# Altium schematic sheet Snickerdoodle FPGA JB.SchDoc: Snickerdoodle JB
size Tabloid; ApprovedBy: NA; CompanyName: Cospan Design LLC; DrawnBy: Dave McCoy; Engineer: Dave McCoy; DocumentNumber: 5; Revision: A; SheetNumber: 5; SheetTotal: 20; Client: Public; Project: Enigma; ProjectPrettyName: Enigma
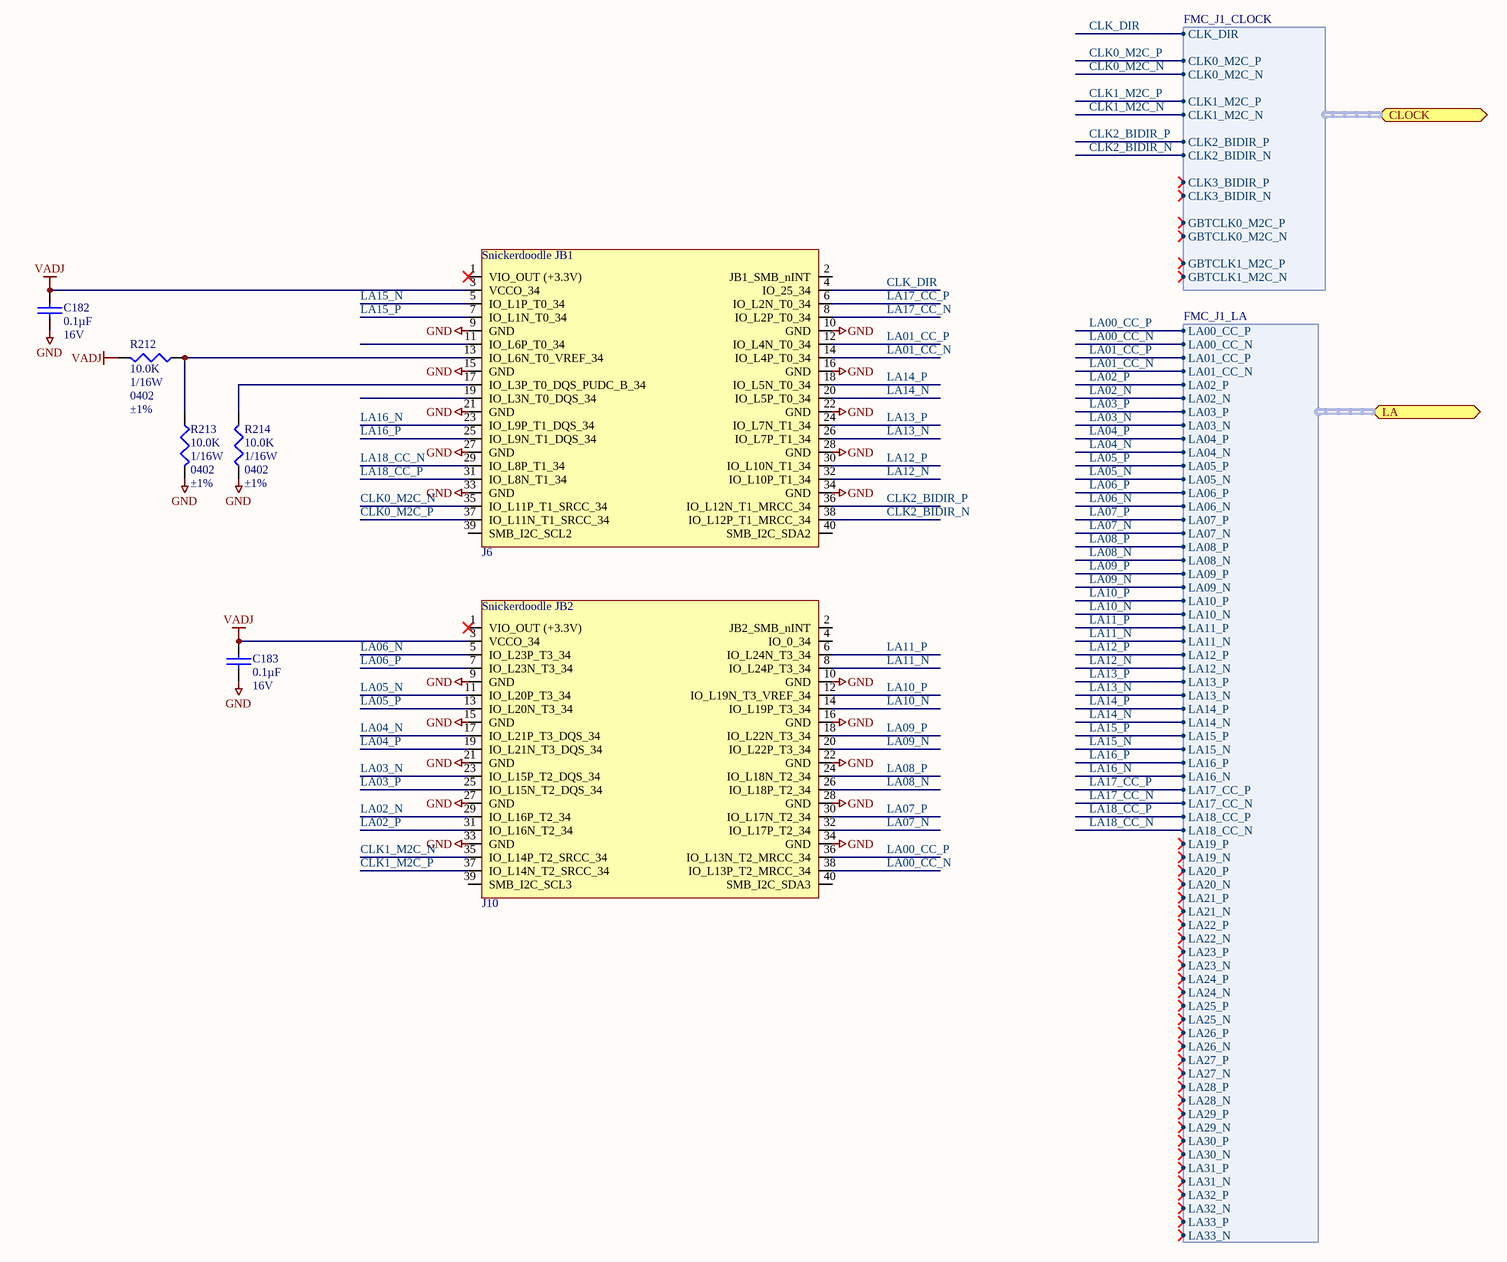
[diagram p0: Snickerdoodle FPGA JB.SchDoc]

## Parts
C182  Capacitance: 0.1µF  Voltage - Rated: 16V  [C_0402]  (hidden comment: 0.1uF)
C183  Capacitance: 0.1µF  Voltage - Rated: 16V  [C_0402]  (hidden comment: 0.1uF)
J6  J_SNICKERDOODLE_JB1  [TFM12001-X-D-A]  (value not drawn)
J10  J_SNICKERDOODLE_JB2  [TFM12001-X-D-A]  (value not drawn)
R212  Resistance In Ohms: 10.0K  Power (Watts): 1/16W  Case: 0402  Tolerance: ±1%  [R_0402]  (hidden comment: R_0402_10.0K)
R213  Resistance In Ohms: 10.0K  Power (Watts): 1/16W  Case: 0402  Tolerance: ±1%  [R_0402]  (hidden comment: R_0402_10.0K)
R214  Resistance In Ohms: 10.0K  Power (Watts): 1/16W  Case: 0402  Tolerance: ±1%  [R_0402]  (hidden comment: R_0402_10.0K)

## Ports
CLOCK (harness FMC_J1_CLOCK), LA (harness FMC_J1_LA)

## Harnesses
FMC_J1_CLOCK: CLK_DIR, CLK0_M2C_N, CLK0_M2C_P, CLK1_M2C_N, CLK1_M2C_P, CLK2_BIDIR_N, CLK2_BIDIR_P, CLK3_BIDIR_N, CLK3_BIDIR_P, GBTCLK0_M2C_N, GBTCLK0_M2C_P, GBTCLK1_M2C_N, GBTCLK1_M2C_P
FMC_J1_LA: LA00_CC_N, LA00_CC_P, LA01_CC_N, LA01_CC_P, LA02_N, LA02_P, LA03_N, LA03_P, LA04_N, LA04_P, LA05_N, LA05_P, LA06_N, LA06_P, LA07_N, LA07_P, LA08_N, LA08_P, LA09_N, LA09_P, LA10_N, LA10_P, LA11_N, LA11_P, LA12_N, LA12_P, LA13_N, LA13_P, LA14_N, LA14_P, LA15_N, LA15_P, LA16_N, LA16_P, LA17_CC_N, LA17_CC_P, LA18_CC_N, LA18_CC_P, LA19_N, LA19_P, LA20_N, LA20_P, LA21_N, LA21_P, LA22_N, LA22_P, LA23_N, LA23_P, LA24_N, LA24_P, LA25_N, LA25_P, LA26_N, LA26_P, LA27_N, LA27_P, LA28_N, LA28_P, LA29_N, LA29_P, LA30_N, LA30_P, LA31_N, LA31_P, LA32_N, LA32_P, LA33_N, LA33_P

## Nets
GND: C182.1 C183.1 J6.9(GND) J6.10(GND) J6.15(GND) J6.16(GND) J6.21(GND) J6.22(GND) J6.27(GND) J6.28(GND) J6.33(GND) J6.34(GND) J10.9(GND) J10.10(GND) J10.15(GND) J10.16(GND) J10.21(GND) J10.22(GND) J10.27(GND) J10.28(GND) J10.33(GND) J10.34(GND) R213.1 R214.2
VADJ: C182.2 C183.2 J6.3(VCCO_34) J10.3(VCCO_34) R212.1
CLK0_M2C_N: J6.35(IO_L11P_T1_SRCC_34) ; port CLOCK.CLK0_M2C_N
CLK0_M2C_P: J6.37(IO_L11N_T1_SRCC_34) ; port CLOCK.CLK0_M2C_P
CLK1_M2C_N: J10.35(IO_L14P_T2_SRCC_34) ; port CLOCK.CLK1_M2C_N
CLK1_M2C_P: J10.37(IO_L14N_T2_SRCC_34) ; port CLOCK.CLK1_M2C_P
CLK2_BIDIR_N: J6.38(IO_L12P_T1_MRCC_34) ; port CLOCK.CLK2_BIDIR_N
CLK2_BIDIR_P: J6.36(IO_L12N_T1_MRCC_34) ; port CLOCK.CLK2_BIDIR_P
CLK_DIR: J6.4(IO_25_34) ; port CLOCK.CLK_DIR
LA00_CC_N: J10.38(IO_L13P_T2_MRCC_34) ; port LA.LA00_CC_N
LA00_CC_P: J10.36(IO_L13N_T2_MRCC_34) ; port LA.LA00_CC_P
LA01_CC_N: J6.14(IO_L4P_T0_34) ; port LA.LA01_CC_N
LA01_CC_P: J6.12(IO_L4N_T0_34) ; port LA.LA01_CC_P
LA02_N: J10.29(IO_L16P_T2_34) ; port LA.LA02_N
LA02_P: J10.31(IO_L16N_T2_34) ; port LA.LA02_P
LA03_N: J10.23(IO_L15P_T2_DQS_34) ; port LA.LA03_N
LA03_P: J10.25(IO_L15N_T2_DQS_34) ; port LA.LA03_P
LA04_N: J10.17(IO_L21P_T3_DQS_34) ; port LA.LA04_N
LA04_P: J10.19(IO_L21N_T3_DQS_34) ; port LA.LA04_P
LA05_N: J10.11(IO_L20P_T3_34) ; port LA.LA05_N
LA05_P: J10.13(IO_L20N_T3_34) ; port LA.LA05_P
LA06_N: J10.5(IO_L23P_T3_34) ; port LA.LA06_N
LA06_P: J10.7(IO_L23N_T3_34) ; port LA.LA06_P
LA07_N: J10.32(IO_L17P_T2_34) ; port LA.LA07_N
LA07_P: J10.30(IO_L17N_T2_34) ; port LA.LA07_P
LA08_N: J10.26(IO_L18P_T2_34) ; port LA.LA08_N
LA08_P: J10.24(IO_L18N_T2_34) ; port LA.LA08_P
LA09_N: J10.20(IO_L22P_T3_34) ; port LA.LA09_N
LA09_P: J10.18(IO_L22N_T3_34) ; port LA.LA09_P
LA10_N: J10.14(IO_L19P_T3_34) ; port LA.LA10_N
LA10_P: J10.12(IO_L19N_T3_VREF_34) ; port LA.LA10_P
LA11_N: J10.8(IO_L24P_T3_34) ; port LA.LA11_N
LA11_P: J10.6(IO_L24N_T3_34) ; port LA.LA11_P
LA12_N: J6.32(IO_L10P_T1_34) ; port LA.LA12_N
LA12_P: J6.30(IO_L10N_T1_34) ; port LA.LA12_P
LA13_N: J6.26(IO_L7P_T1_34) ; port LA.LA13_N
LA13_P: J6.24(IO_L7N_T1_34) ; port LA.LA13_P
LA14_N: J6.20(IO_L5P_T0_34) ; port LA.LA14_N
LA14_P: J6.18(IO_L5N_T0_34) ; port LA.LA14_P
LA15_N: J6.5(IO_L1P_T0_34) ; port LA.LA15_N
LA15_P: J6.7(IO_L1N_T0_34) ; port LA.LA15_P
LA16_N: J6.23(IO_L9P_T1_DQS_34) ; port LA.LA16_N
LA16_P: J6.25(IO_L9N_T1_DQS_34) ; port LA.LA16_P
LA17_CC_N: J6.8(IO_L2P_T0_34) ; port LA.LA17_CC_N
LA17_CC_P: J6.6(IO_L2N_T0_34) ; port LA.LA17_CC_P
LA18_CC_N: J6.29(IO_L8P_T1_34) ; port LA.LA18_CC_N
LA18_CC_P: J6.31(IO_L8N_T1_34) ; port LA.LA18_CC_P
NetJ6_13: J6.13(IO_L6N_T0_VREF_34) R212.2 R213.2
NetJ6_17: J6.17(IO_L3P_T0_DQS_PUDC_B_34) R214.1

Not connected (* = marked no-connect by the designer): J6 1(VIO_OUT_(+3.3V))* 2(JB1_SMB_nINT) 11(IO_L6P_T0_34) 19(IO_L3N_T0_DQS_34) 39(SMB_I2C_SCL2) 40(SMB_I2C_SDA2); J10 1(VIO_OUT_(+3.3V))* 2(JB2_SMB_nINT) 4(IO_0_34) 39(SMB_I2C_SCL3) 40(SMB_I2C_SDA3)

## Notes on the sheet
- Project:
- http://www.cospandesign.com
- Cospan Design
- Document:
- Engineer:
- Title:
- Client:
- Approved By:
- Revision:
- Date:
- Number:
- of
- (in symbol J_SNICKERDOODLE_JB1) Snickerdoodle JB1
- (in symbol J_SNICKERDOODLE_JB2) Snickerdoodle JB2

## Library data of the parts
C182 C183 = C_0402_0.1UF_16V: CAP CER .10UF 16V X7R 0402; Manufacturer: TDK Corporation; Manufacturer Part Number: C1005X7R1C104K050BC; Tolerance: ±10%; Supplier 1: Digi-Key; RoHS: RoHS Compliant; Category: Capacitors; Stock 1: 2696686; Pricing 1: 1=0.1, 10=0.05, 100=0.0231, 250=0.01892, 500=0.01618, 1000=0.0126, 5000=0.0105 (USD); Packaging: Cut Tape (CT); Part Status: Not For New Designs; Operating Temperature: -55°C ~ 125°C; Features: Low ESL; Ratings: -; Applications: General Purpose; Failure Rate: -; Mounting Type: Surface Mount, MLCC; Size / Dimension: 0.039" L x 0.020" W (1.00mm x 0.50mm); Height - Seated (Max): -; Thickness (Max): 0.022" (0.55mm); Lead Spacing: -; Lead Style: -; ComponentLink1URL: https://product.tdk.com/info/en/catalog/datasheets/mlcc_commercial_general_en.pdf; ComponentLink1Description: https://product.tdk.com/info/en/catalog/datasheets/mlcc_commercial_general_en.pdf; Supplier Part Number 1: 445-4952-1-ND; Temperature Coefficient: X7R; Package / Case: 0402
R212-R214 = R_0402_10.0K: RES 10.0K OHM 1/16W 1% 0402 SMD; Manufacturer: Stackpole Electronics Inc; Manufacturer Part Number: RMCF0402FT10K0; Resistance (Ohms): 10k; Temperature Coefficient: ±100ppm/°C; Supplier 1: Digi-Key; Supplier Part Number 1: RMCF0402FT10K0CT-ND; RoHS: RoHS Compliant; Category: Resistors; Stock 1: 234525; Pricing: 1=0.04, 10=0.025, 50=0.0138, 100=0.0105, 250=0.0078, 500=0.00576, 1000=0.00384, 2500=0.00324, 5000=0.0027 (USD); Composition: Thick Film; Features: -; Package / Case: 0402 (1005 Metric); Size / Dimension: 0.039" L x 0.020" W (1.00mm x 0.50mm); Height: 0.016" (0.40mm); Number of Terminations: 2; Packaging: Cut Tape (CT); ComponentLink1URL: http://www.seielect.com/Catalog/SEI-RMCF_RMCP.pdf; ComponentLink1Description: http://www.seielect.com/Catalog/SEI-RMCF_RMCP.pdf